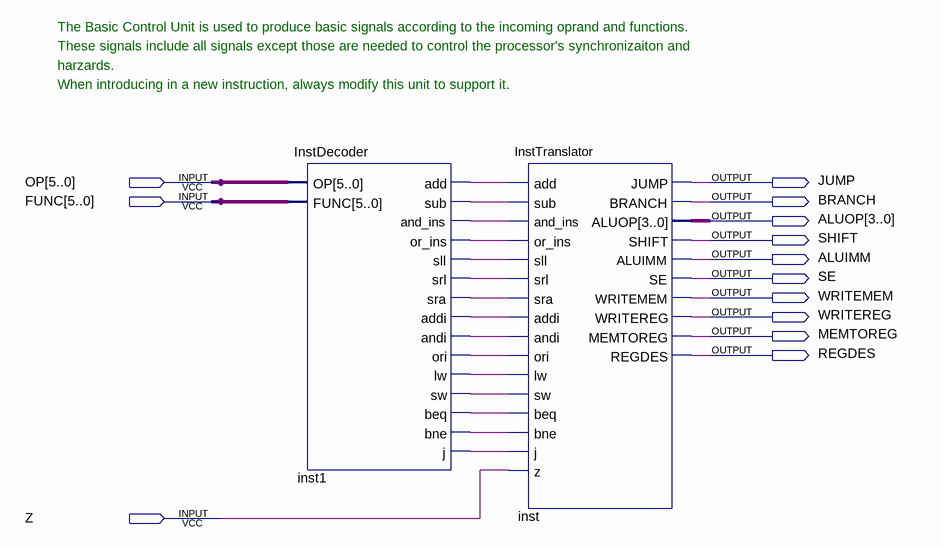
[diagram p0: schematic sheet]
// Quartus schematic BasicControlUnit.bdf as structural Verilog: 2 symbols, 13 pins
module BasicControlUnit (
  input  [5:0] OP,
  input  [5:0] FUNC,
  input  Z,
  output JUMP,
  output BRANCH,
  output [3:0] ALUOP,
  output SHIFT,
  output ALUIMM,
  output SE,
  output WRITEMEM,
  output WRITEREG,
  output MEMTOREG,
  output REGDES
);

  wire inst1_add, inst1_addi, inst1_and_ins, inst1_andi, inst1_beq, inst1_bne, inst1_j, inst1_lw,
       inst1_or_ins, inst1_ori, inst1_sll, inst1_sra, inst1_srl, inst1_sub, inst1_sw;

  InstDecoder inst1 (
    .OP(OP), .FUNC(FUNC), .add(inst1_add), .sub(inst1_sub), .and_ins(inst1_and_ins), .or_ins(inst1_or_ins),
    .sll(inst1_sll), .srl(inst1_srl), .sra(inst1_sra), .addi(inst1_addi), .andi(inst1_andi), .ori(inst1_ori),
    .lw(inst1_lw), .sw(inst1_sw), .beq(inst1_beq), .bne(inst1_bne), .j(inst1_j));
  InstTranslator inst (
    .add(inst1_add), .sub(inst1_sub), .and_ins(inst1_and_ins), .or_ins(inst1_or_ins), .sll(inst1_sll),
    .srl(inst1_srl), .sra(inst1_sra), .addi(inst1_addi), .andi(inst1_andi), .ori(inst1_ori), .lw(inst1_lw),
    .sw(inst1_sw), .beq(inst1_beq), .bne(inst1_bne), .j(inst1_j), .z(Z), .JUMP(JUMP), .BRANCH(BRANCH),
    .ALUOP(ALUOP), .SHIFT(SHIFT), .ALUIMM(ALUIMM), .SE(SE), .WRITEMEM(WRITEMEM), .WRITEREG(WRITEREG),
    .MEMTOREG(MEMTOREG), .REGDES(REGDES));

  // Notes on the sheet:
  //   The Basic Control Unit is used to produce basic signals according to the incoming oprand and functions.
  //   These signals include all signals except those are needed to control the processor's synchronizaiton and
  //   harzards.
  //   When introducing in a new instruction, always modify this unit to support it.
endmodule
